# Altium project Si4703_Eval_v13.PrjPcb
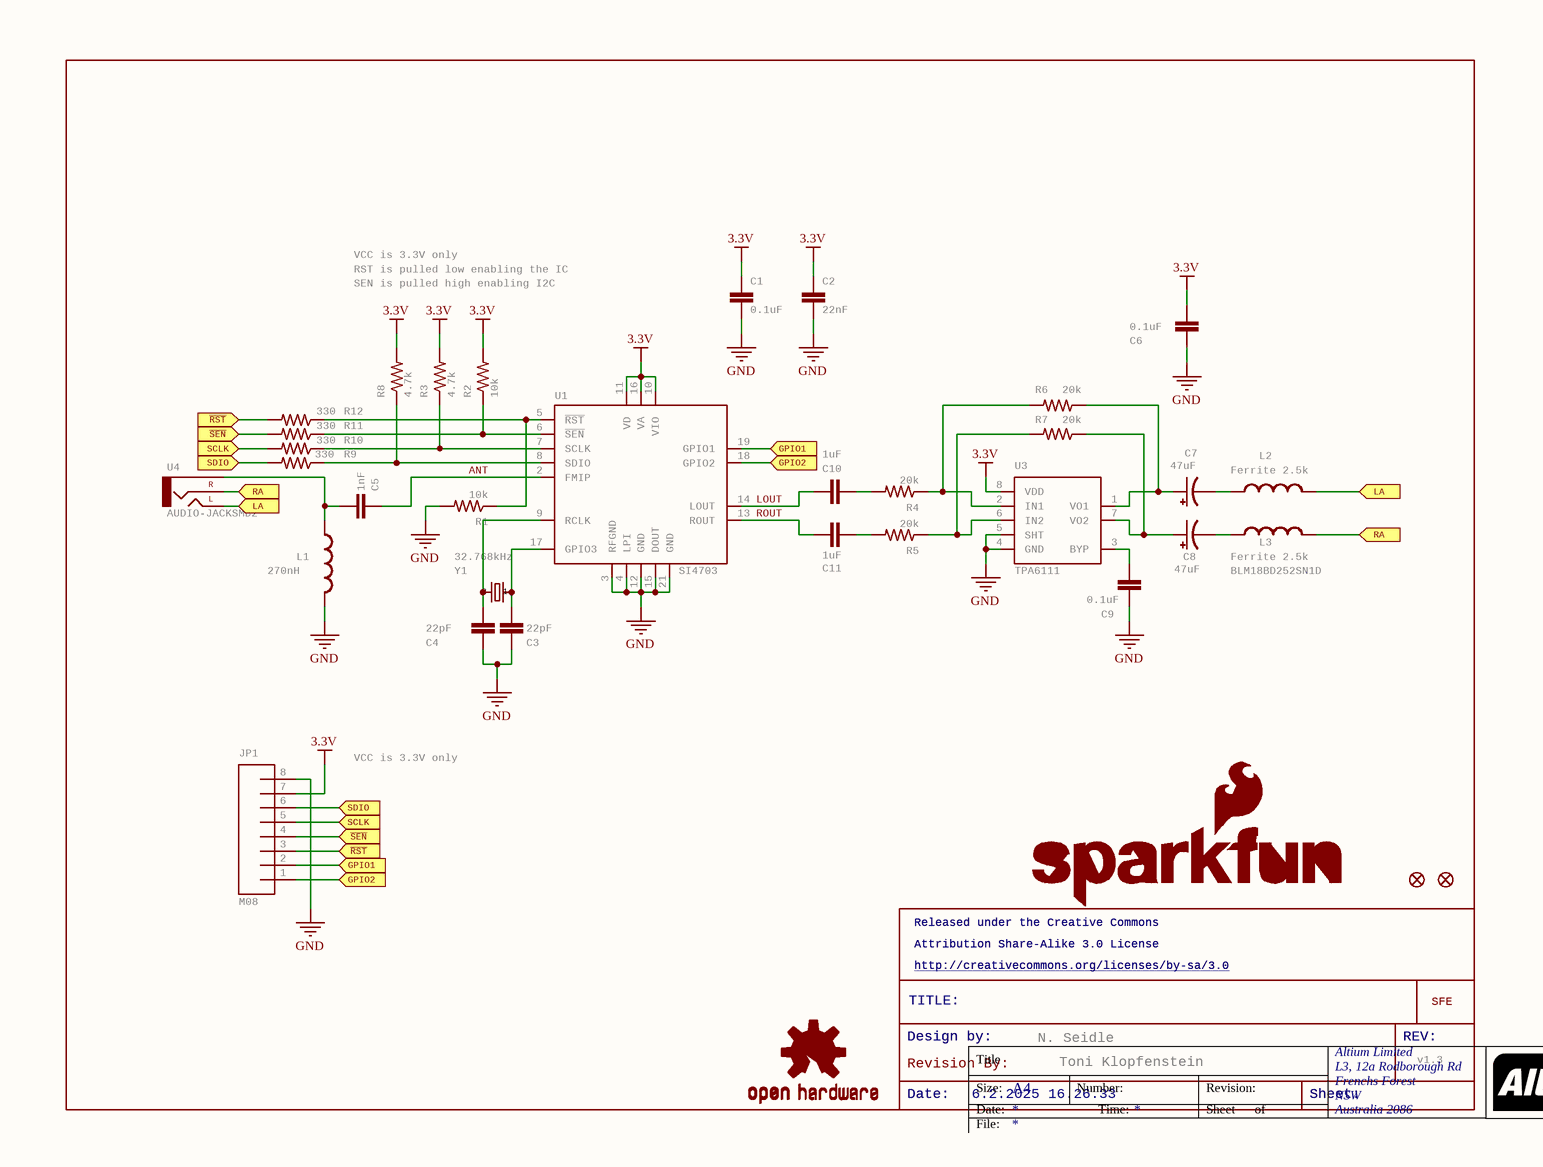
[diagram p0: Si4703_Eval_v13.SchDoc]
1 sheet, 37 parts. Net scope: flat (ports and power ports of the same name join across sheets).
Board file: Si4703_Eval_v13.PcbDoc

## Sheet Si4703_Eval_v13.SchDoc
size 270 x 204 mm; Date: 6.2.2025 16.26.33; Date: 6.2.2025 16.26.33; Organization: Altium Limited; Address1: L3, 12a Rodborough Rd; Address2: Frenchs Forest; Address3: NSW; Address4: Australia 2086; Origin: Eagle

### Parts
C1  value 0.1uF  [0603-CAP]
C2  value 22nF  [0603-CAP]
C3  value 22pF  [0603-CAP]
C4  value 22pF  [0603-CAP]
C5  value 1nF  [0603-CAP]
C6  value 0.1uF  [0603-CAP]
C7  value 47uF  [EIA3528]
C8  value 47uF  [EIA3528]
C9  value 0.1uF  [0603-CAP]
C10  value 1uF  [0603-CAP]
C11  value 1uF  [0603-CAP]
JP1  M08  [1X08]
JP3  LOGO-SFESK  [SFE-LOGO-FLAME]  (value not drawn)
JP4  FIDUCIAL1X2  [FIDUCIAL-1X2]  (value not drawn)
JP5  FIDUCIAL1X2  [FIDUCIAL-1X2]  (value not drawn)
L1  value 270nH  [0603]
L2  value Ferrite 2.5k  [0603]
L3  value Ferrite 2.5k  [0603]
LOGO1  SFE_LOGO_NAME_FLAME.1_INCH  [SFE_LOGO_NAME_FLAME_.1]  (value not drawn)
LOGO2  OSHW-LOGOS  [OSHW-LOGO-S]  (value not drawn)
R1  value 10k  [0603-RES]
R2  value 10k  [0603-RES]
R3  value 4.7k  [0603]
R4  value 20k  [0603-RES]
R5  value 20k  [0603-RES]
R6  value 20k  [0603-RES]
R7  value 20k  [0603-RES]
R8  value 4.7k  [0603]
R9  value 330  [0603-RES]
R10  value 330  [0603-RES]
R11  value 330  [0603-RES]
R12  value 330  [0603-RES]
U1  SI4703  [SI470X]
U3  TPA6111  [SO08-TIGHT]
U4  AUDIO-JACKSMD2  [AUDIO-JACK-3.5MM-SMD]
U$1  RevisionBy: Revision By:  [REVISION]  (hidden comment: REVISION)
Y1  value 32.768kHz  [CRYSTAL-32KHZ-SMD]

### Ports
GPIO1 (in), GPIO2 (in), LA (in), RA (in), SCLK (in), SDIO (in), ~{RST} (in), ~{SEN} (in)

### Nets
3.3V: C1.1 C1.2 C2.1 C2.2 C3.1 C4.1 C6.1 C6.2 C9.2 JP1.7 JP1.8 L1.2 R1.2 R2.2 R3.2 R8.2 U1.3(RFGND) U1.4(LPI) U1.10(VIO) U1.11(VD) U1.12(GND) U1.15(DOUT) U1.16(VA) U1.21(GND) U3.4(GND) U3.5(SHT) U3.8(VDD)  [also labelled GND]
ANT: C5.1 U1.2(FMIP)
LOUT: C10.1 U1.14(LOUT)
ROUT: C11.1 U1.13(ROUT)
NetC3_2: C3.2 U1.17(GPIO3) Y1.X1
NetC4_2: C4.2 U1.9(RCLK) Y1.X2
NetC5_2: C5.2 L1.1 U4.SLEEVE
NetC7_A: C7.A(+) R6.1 U3.1(VO1)
NetC7_C: C7.C(-) L2.1
NetC8_A: C8.A(+) R7.1 U3.7(VO2)
NetC8_C: C8.C(-) L3.1
NetC9_1: C9.1 U3.3(BYP)
NetC10_2: C10.2 R4.2
NetC11_2: C11.2 R5.2
NetJP1_1: JP1.1 U1.18(GPIO2) ; port GPIO2
NetJP1_2: JP1.2 U1.19(GPIO1) ; port GPIO1
NetJP1_3: JP1.3 R12.2 ; port ~{RST}
NetJP1_4: JP1.4 R11.2 ; port ~{SEN}
NetJP1_5: JP1.5 R10.2 ; port SCLK
NetJP1_6: JP1.6 R9.2 ; port SDIO
NetL2_2: L2.2 U4.TIP(LEFT) ; port LA
NetL3_2: L3.2 U4.RING(RIGHT) ; port RA
NetR1_1: R1.1 R12.1 U1.5(~{RST})
NetR2_1: R2.1 R11.1 U1.6(~{SEN})
NetR3_1: R3.1 R10.1 U1.7(SCLK)
NetR4_1: R4.1 R6.2 U3.2(IN1)
NetR5_1: R5.1 R7.2 U3.6(IN2)
NetR8_1: R8.1 R9.1 U1.8(SDIO)

### Notes on the sheet
- VCC is 3.3V only
- SEN is pulled high enabling I2C
- RST is pulled low enabling the IC
- BLM18BD252SN1D
- (near LOGO1) Released under the Creative Commons
- (near LOGO1) Attribution Share-Alike 3.0 License
- (near LOGO1) http://creativecommons.org/licenses/by-sa/3.0
- (near U$1) Design by:
- TITLE:
- N. Seidle
- (near JP3) REV:
- (near U$1) Date:
- 6.2.2025 16.26.33
- Toni Klopfenstein
- Sheet:
- (near JP3) v1.3
- Title
- Size:
- A4
- Number:
- Time:
- Revision:
- Sheet
- of
- File:

### Library data of the parts
C1 C6 C9 = 0.1UF-25V(+80/-20%)(0603): CAP-00810 Ceramic Standard decoupling cap; GateName_1: G$1; SymbolName_1: CAP; LibraryName: SparkFun-Capacitors; DeviceSetName: 0.1UF-25V(+80/-20%)(0603); PROD_ID: CAP-00810
C2 = 22NF/22,000PF-50V-10%(0603): CAP-07885; GateName_1: G$1; SymbolName_1: CAP; LibraryName: SparkFun-Capacitors; DeviceSetName: 22NF/22,000PF-50V-10%(0603); PROD_ID: CAP-07885
C3 C4 = 22PF-50V-5%(0603): CAP-07876; GateName_1: G$1; SymbolName_1: CAP; LibraryName: SparkFun-Capacitors; DeviceSetName: 22PF-50V-5%(0603); PROD_ID: CAP-07876
C5 = 1NF/1000PF-50V-10%(0603): CAP-07886; GateName_1: G$1; SymbolName_1: CAP; LibraryName: SparkFun-Capacitors; DeviceSetName: 1NF/1000PF-50V-10%(0603); PROD_ID: CAP-07886
C7 C8 = 47UF-TANT: 47uF Tantalum SMT CAP-08310- 10V 10% (EIA-3528); GateName_1: G$1; SymbolName_1: CAP_POL; LibraryName: SparkFun-Capacitors; DeviceSetName: 47UF-TANT; PROD_ID: CAP-08310
C10 C11 = 1.0UF-16V-10%(0603): CAP-00868; GateName_1: G$1; SymbolName_1: CAP; LibraryName: SparkFun-Capacitors; DeviceSetName: 1.0UF-16V-10%(0603); PROD_ID: CAP-00868
JP1 = M08: Header 8Standard 8-pin 0.1" header. Use with straight break away headers (SKU : PRT-00116), right angle break away headers (PRT-00553), swiss pins (PRT-00743), machine pins (PRT-00117), and female headers (PRT-00115).; GateName_1: G$1; SymbolName_1: M08; LibraryName: SparkFun; DeviceSetName: M08
JP3 = LOGO-SFESK: Spark Fun Electronics PCB LogoThis is the standard Spark Fun Electronics PCB logo.; GateName_1: G$1; SymbolName_1: LOGO1; DeviceName: SK; LibraryName: SparkFun; DeviceSetName: LOGO-SFE; SFE: SFE
JP4 JP5 = FIDUCIAL1X2: Fiducial Alignment PointsVarious fiducial points for machine vision alignment.; GateName_1: G$1; DeviceName: 1X2; SymbolName_1: FIDUCIAL; LibraryName: SparkFun; DeviceSetName: FIDUCIAL
L1-L3 = INDUCTOR0603: Inductors   Basic Inductor/Choke - 0603 and 1206. Footprints are not proven and vary greatly between part numbers. SRN6045- 33uH, 20% 1.4A SDR0403-560KL - 56uH, 10%, 500mA RMS/740mA peak; GateName_1: G$1; SymbolName_1: INDUCTOR; DeviceName: 0603; LibraryName: SparkFun-Passives; DeviceSetName: INDUCTOR
LOGO1 = SFE_LOGO_NAME_FLAME.1_INCH: SFE Logo, name and flame    This is the SparkFun full logo. The logo on the schematic will always be the same size; the package variant is the height of the flame part of the logo. Default layer for the logo on the board is tSilk.; GateName_1: G$1; SymbolName_1: SFE_LOGO_NAME_FLAME; DeviceName: .1_INCH; LibraryName: SparkFun-Aesthetics; DeviceSetName: SFE_LOGO_NAME_FLAME
LOGO2 = OSHW-LOGOS: Open Source Hardware Logo This logo indicates the piece of hardware it is found on incorporates a OSHW license and/or adheres to the definition of open source hardware found here: http://freedomdefined.org/OSHW; GateName_1: G$1; DeviceName: S; SymbolName_1: OSHW-LOGO; LibraryName: SparkFun-Aesthetics; DeviceSetName: OSHW-LOGO
R1 R2 = 10KOHM1/10W1%(0603)0603: RES-00824; GateName_1: G$1; SymbolName_1: RESISTOR; DeviceName: 0603; LibraryName: SparkFun-Resistors; DeviceSetName: 10KOHM1/10W1%(0603); PROD_ID: RES-00824
R3 R8 = 4.7KOHM1/10W1%(0603): RES-07857; GateName_1: G$1; SymbolName_1: RESISTOR; LibraryName: SparkFun-Resistors; DeviceSetName: 4.7KOHM1/10W1%(0603); PROD_ID: RES-07857
R4-R7 = 20KOHM1/10W1%(0603): RES-09383; GateName_1: G$1; SymbolName_1: RESISTOR; LibraryName: SparkFun-Resistors; DeviceSetName: 20KOHM1/10W1%(0603); PROD_ID: RES-09383
R9-R12 = 330OHM1/10W1%(0603): RES-00818; GateName_1: G$1; SymbolName_1: RESISTOR; LibraryName: SparkFun-Resistors; DeviceSetName: 330OHM1/10W1%(0603); PROD_ID: RES-00818
U1 = SI470X: FM receiver IC. Tested with Si4703. You really only need SEN, RST, SCLK, and SDIO to get a full FM radio working. Antenna comes from headphone jack. See BOB-10344.; GateName_1: G$1; SymbolName_1: SI470X; LibraryName: SparkFun-RF; DeviceSetName: SI470X
U3 = TPA6111SMD-T: GateName_1: G$1; DeviceName: SMD-T; PROD_ID: IC-10149; SymbolName_1: TPA6111; LibraryName: SparkFun-AnalogIC; DeviceSetName: TPA6111
U4 = AUDIO-JACKSMD2: 3.5mm Audio JackSimple 3.5mm common PCB mount audio jack. SKU: PRT-08032; GateName_1: G$1; DeviceName: SMD2; SymbolName_1: AUDIO-JACK; LibraryName: SparkFun-Connectors; DeviceSetName: AUDIO-JACK; L: L; R: R
U$1 = REVISION: GateName_1: G$1; SymbolName_1: REVISION; LibraryName: SparkFun-Aesthetics; DeviceSetName: REVISION
Y1 = CRYSTAL32-SMD: Various standard crystals. Proven footprints. Spark Fun Electronics SKU : COM-00534; GateName_1: G$1; SymbolName_1: Q; DeviceName: 32-SMD; PROD_ID: XTAL-07894; LibraryName: SparkFun-FreqCtrl; DeviceSetName: CRYSTAL; 1: 1; 2: 2